# Altium project Pixhack2.81.PrjPcb
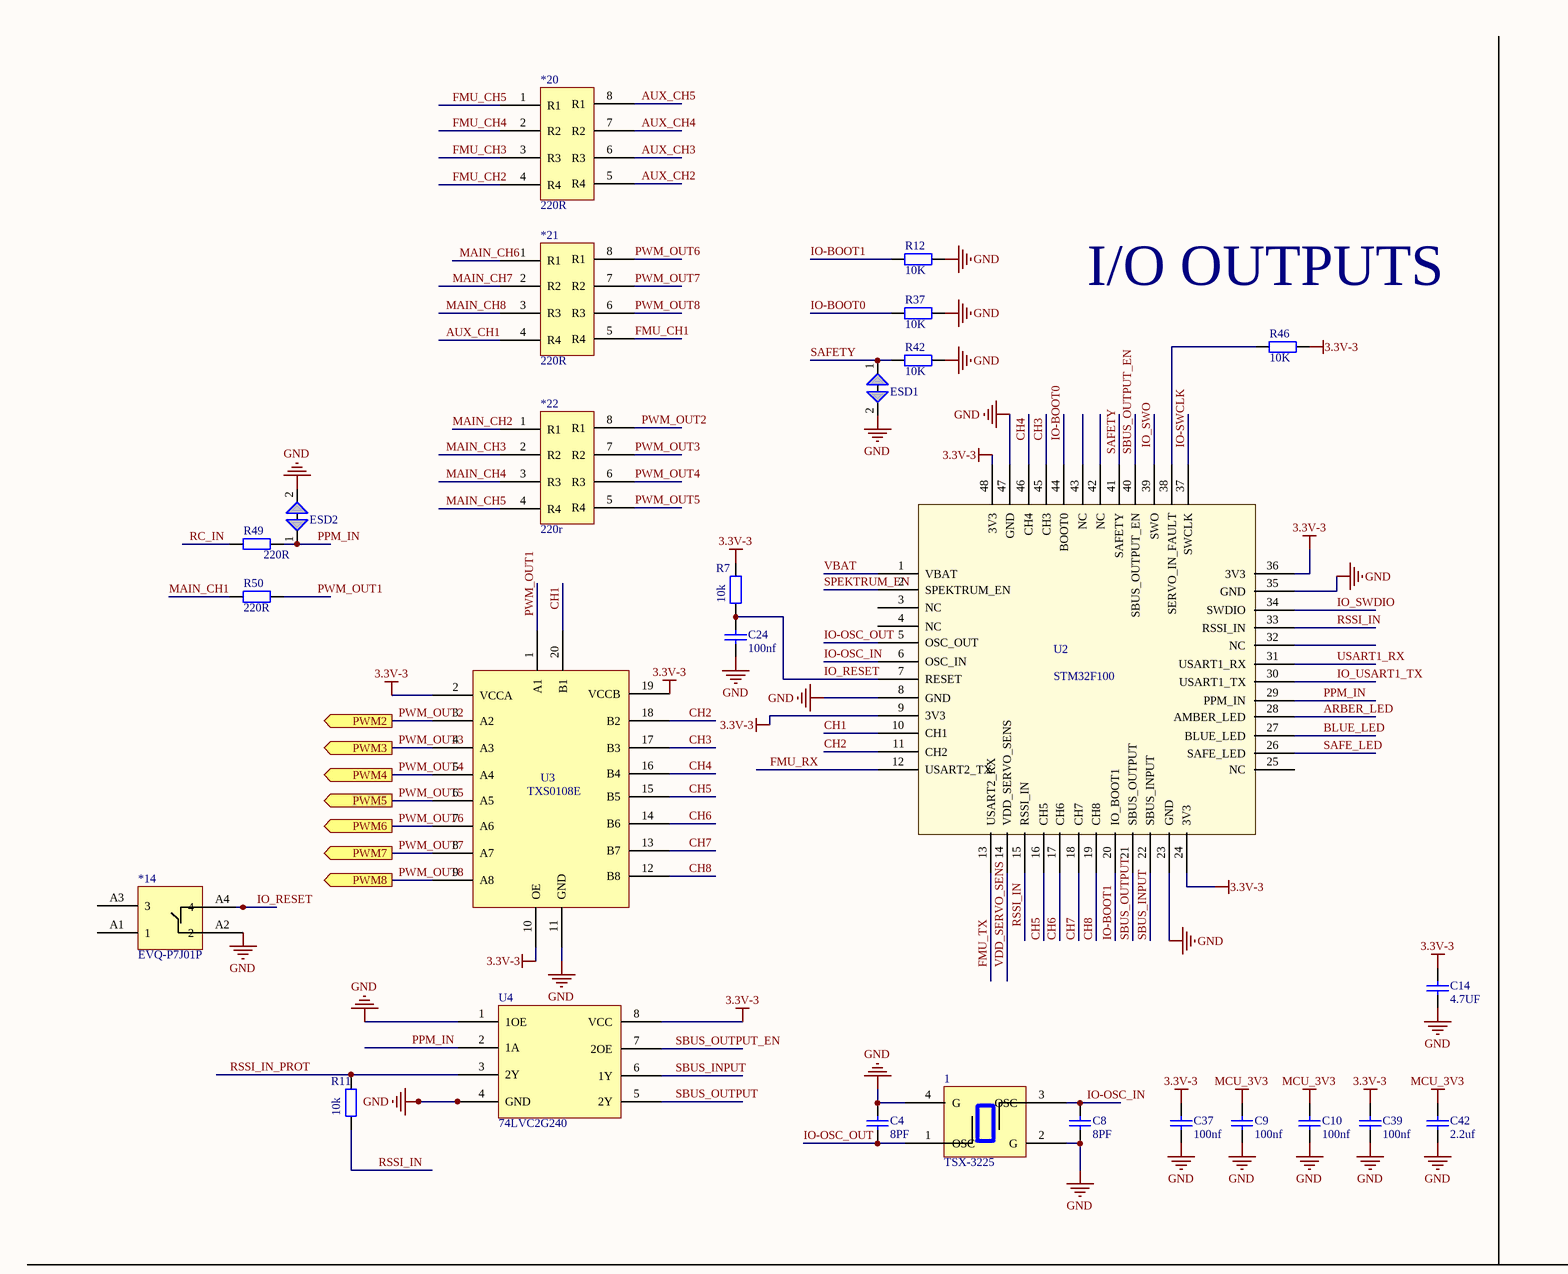
[diagram p0: NEW_LDO_PIX_SH.SchDoc, top left]
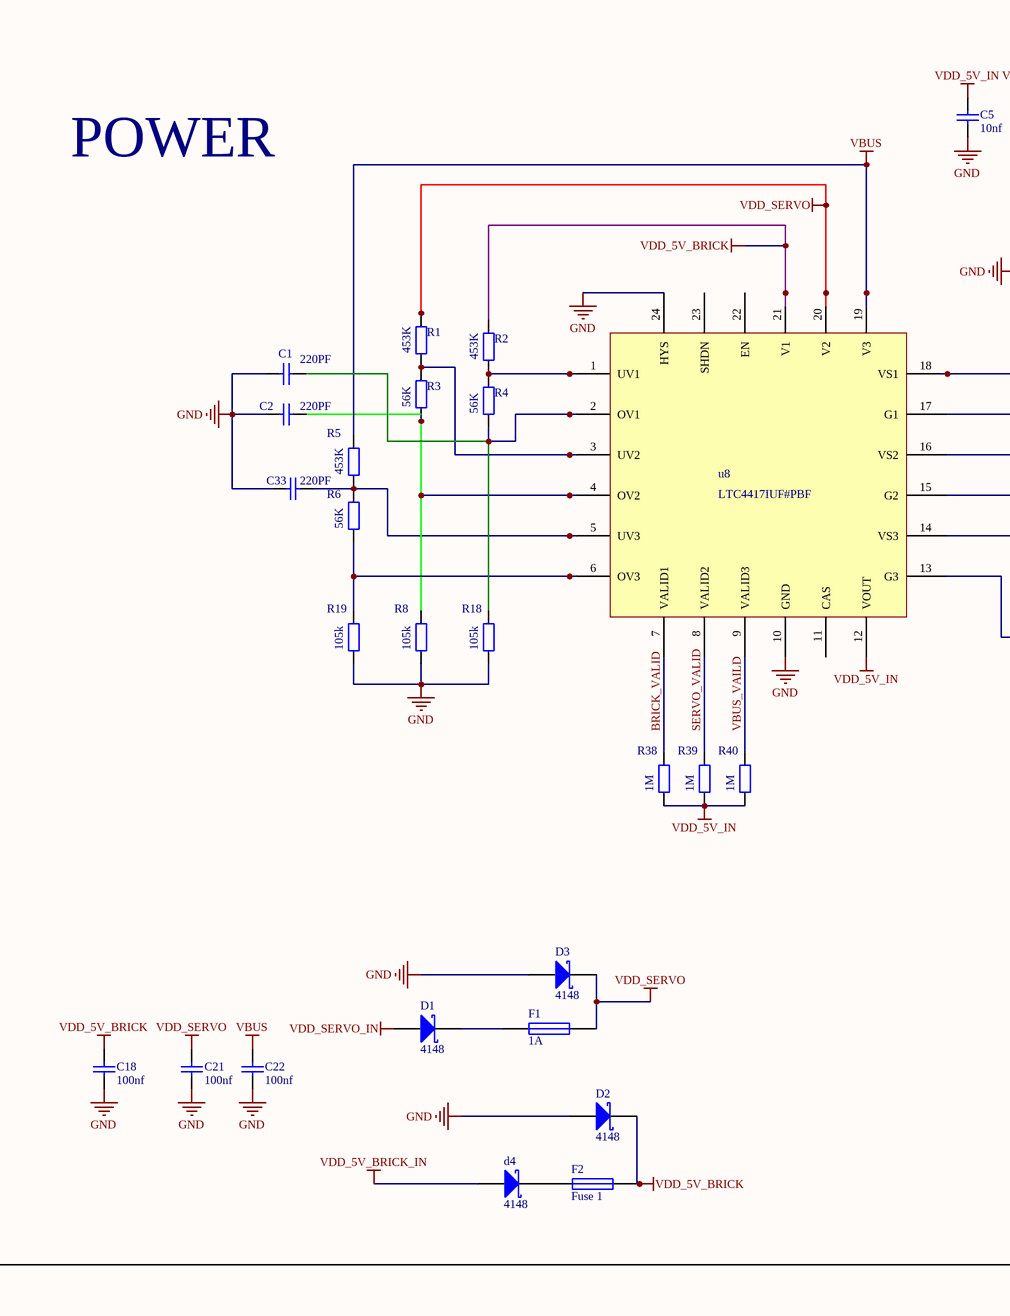
[diagram p1: NEW_LDO_PIX_SH.SchDoc, top middle]
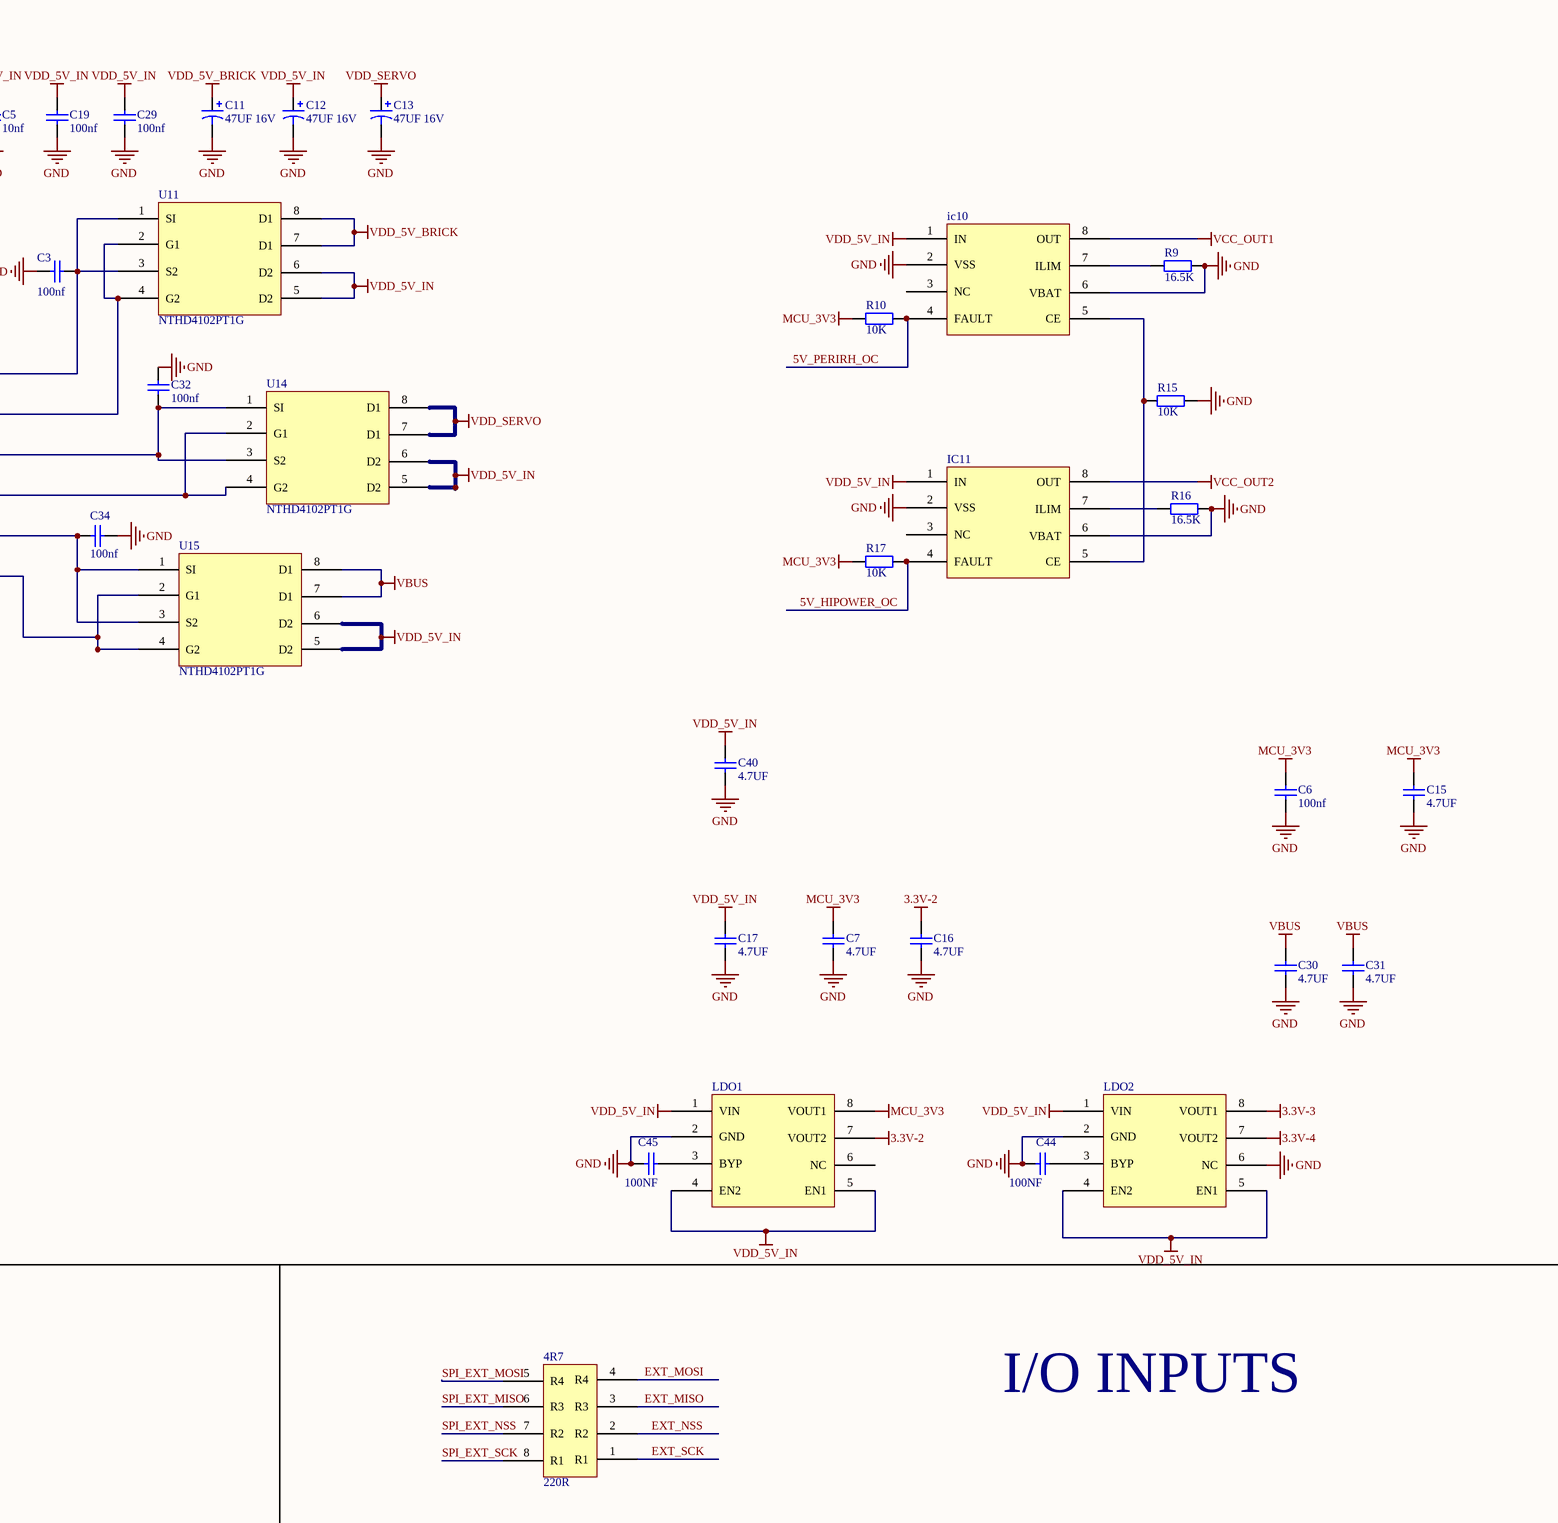
[diagram p2: NEW_LDO_PIX_SH.SchDoc, top right]
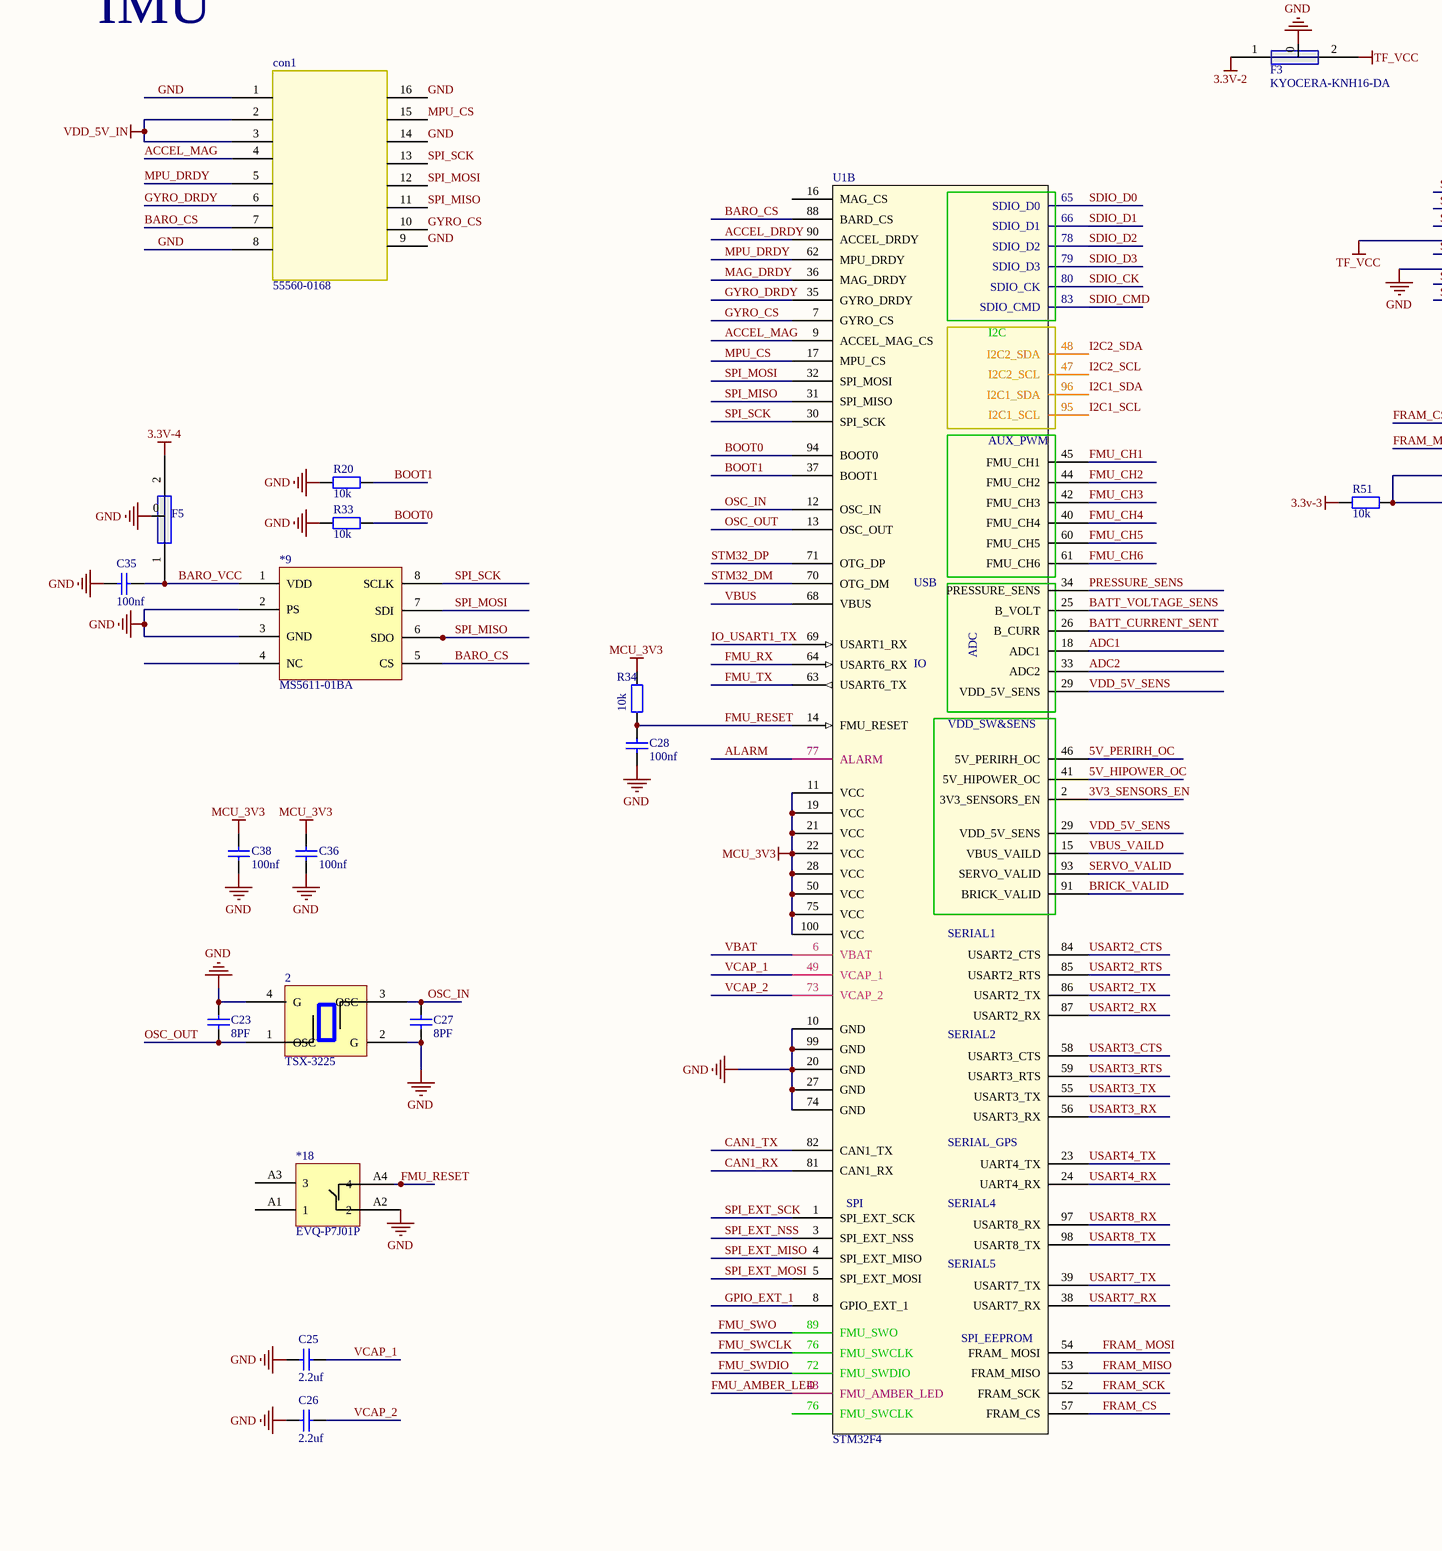
[diagram p3: NEW_LDO_PIX_SH.SchDoc, bottom left]
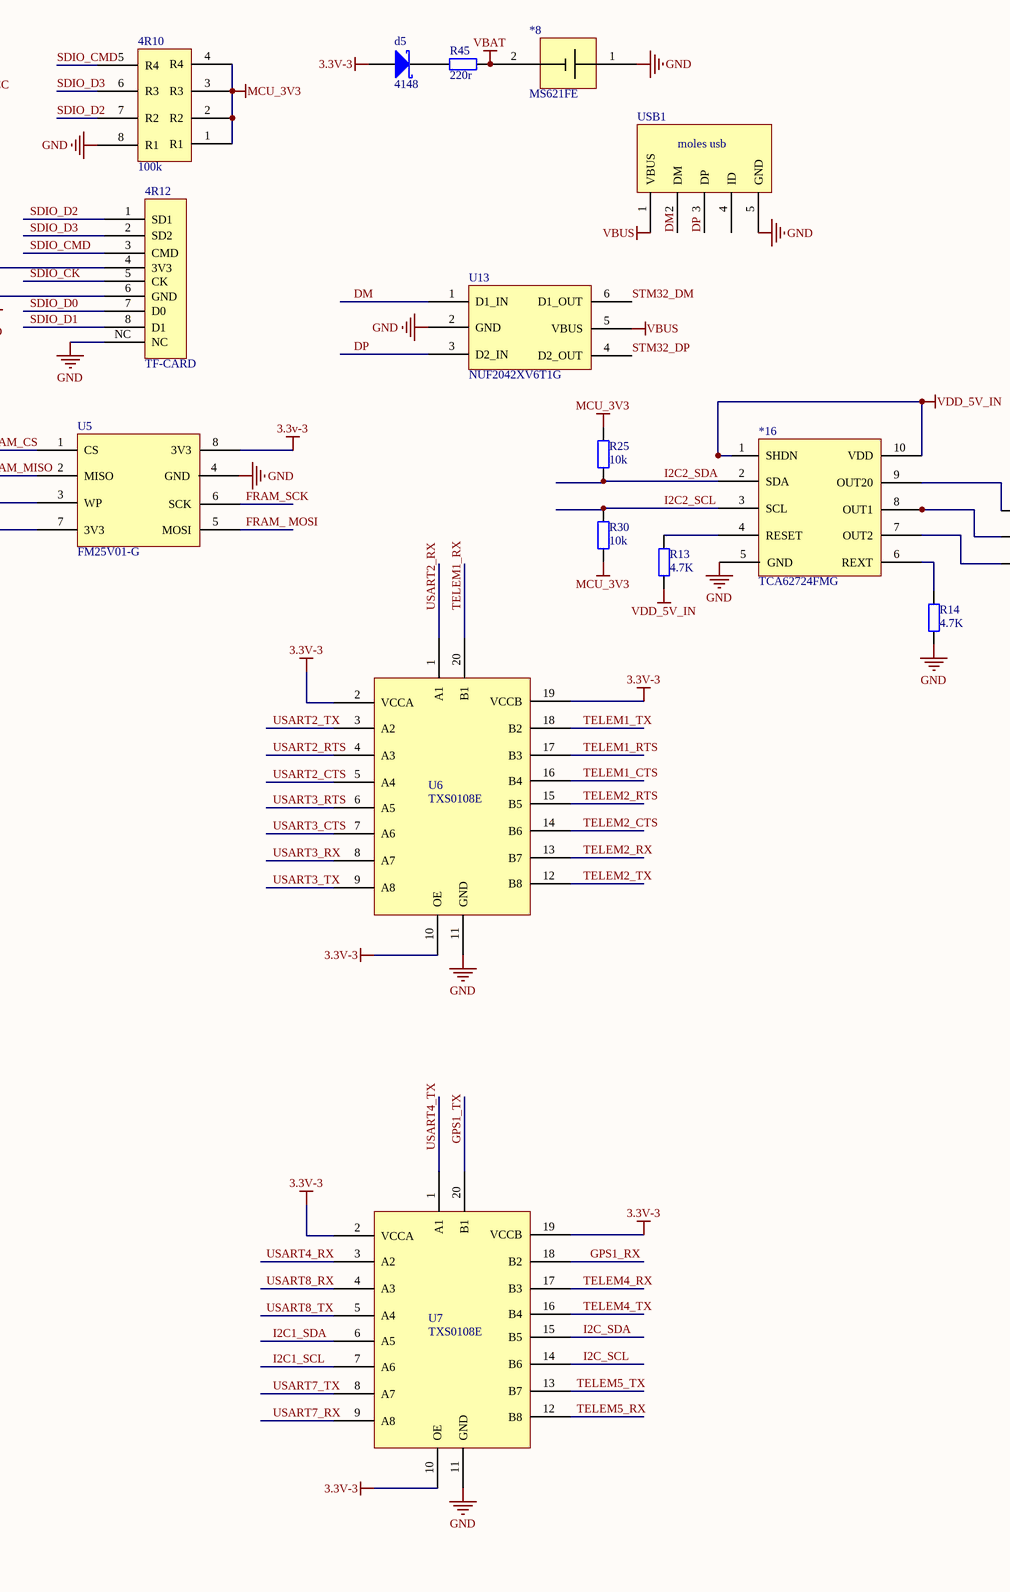
[diagram p4: NEW_LDO_PIX_SH.SchDoc, bottom middle]
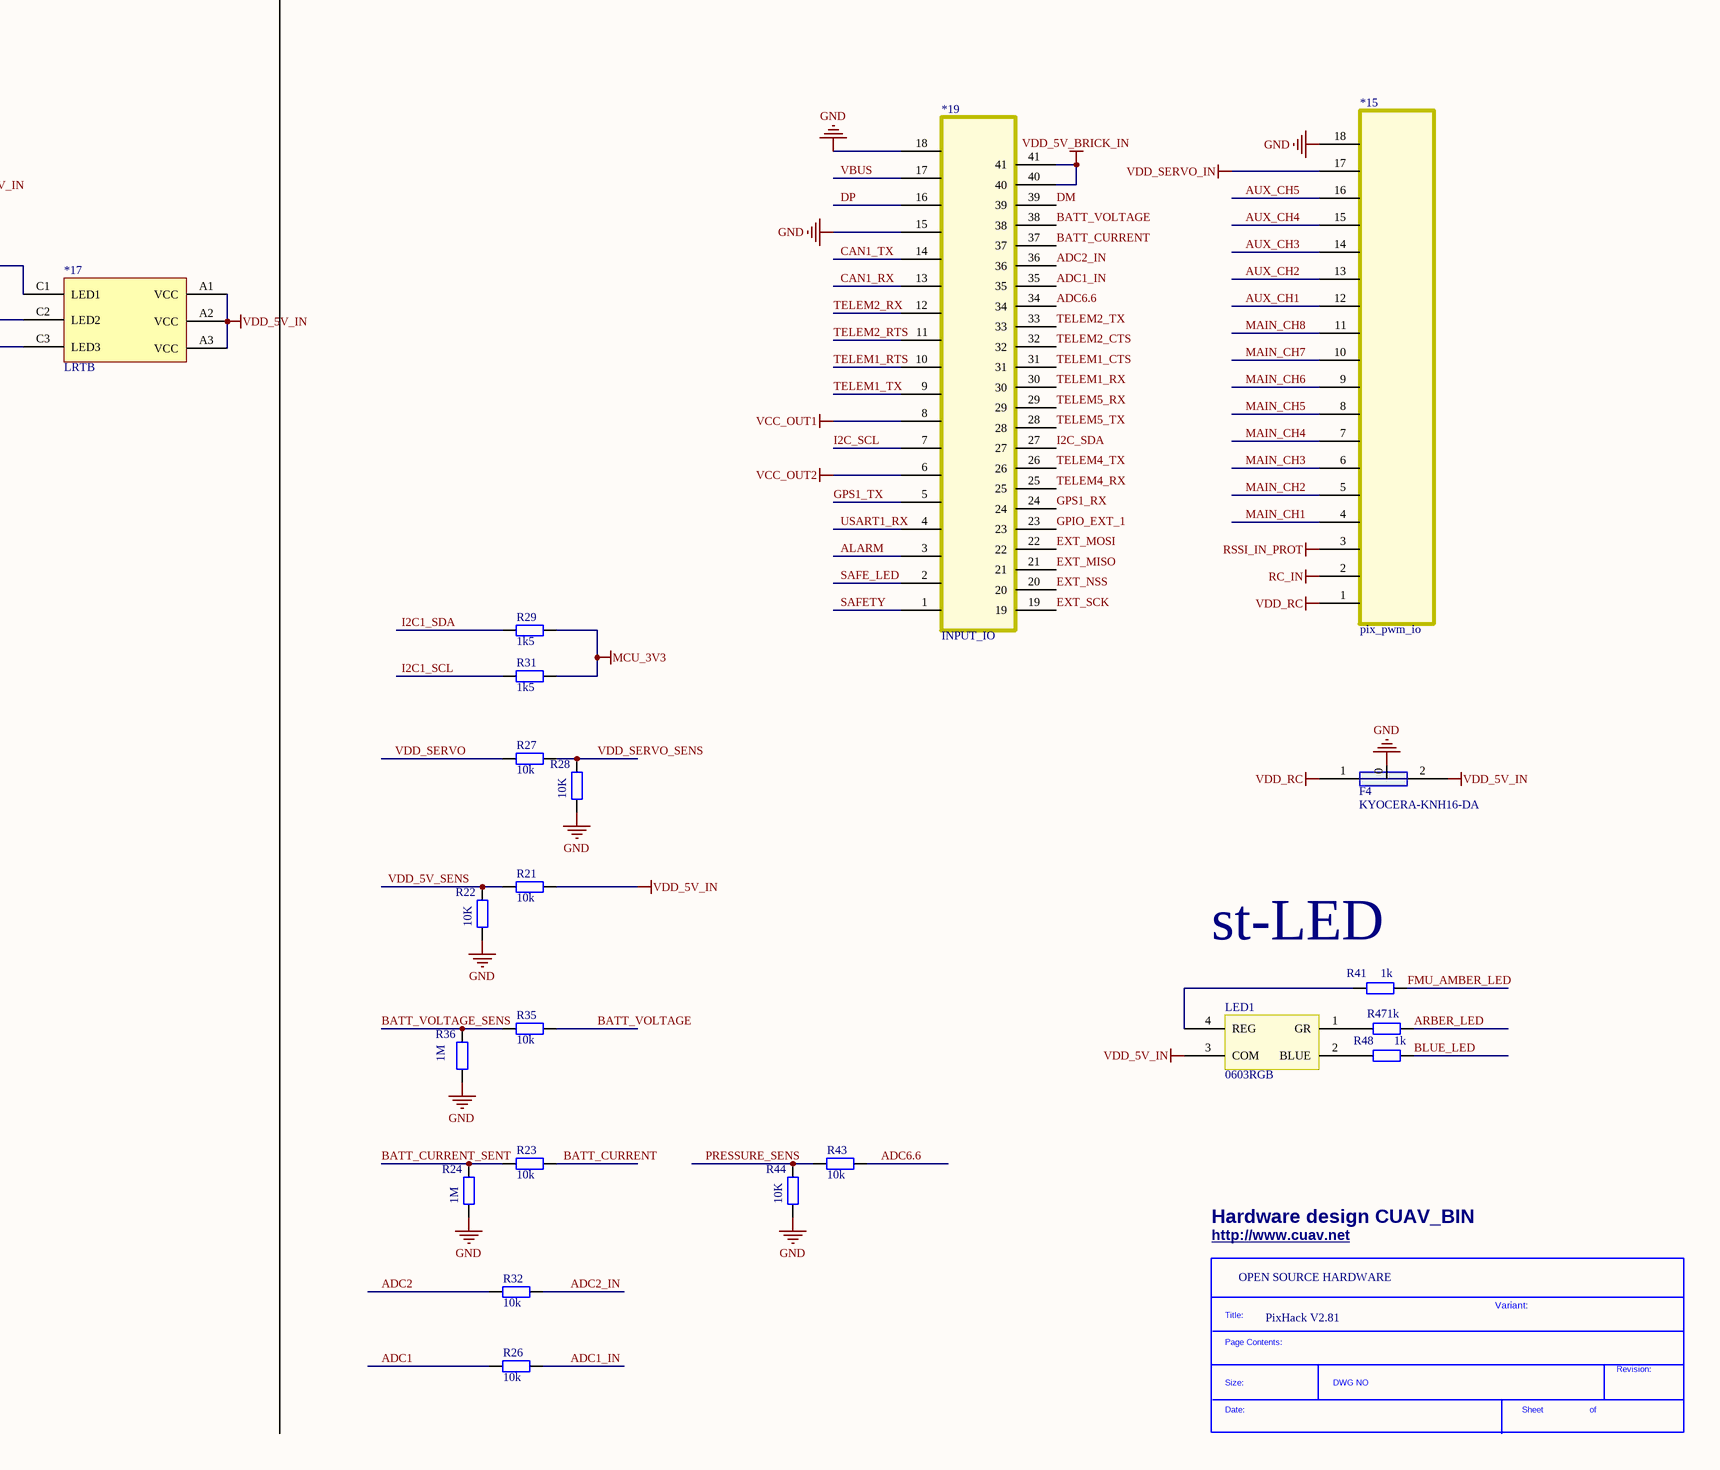
[diagram p5: NEW_LDO_PIX_SH.SchDoc, bottom right]
1 sheet, 141 parts. Net scope: flat (ports and power ports of the same name join across sheets).
Board file: PIXHACK.PcbDoc

## Sheet NEW_LDO_PIX_SH.SchDoc
size A1

### Parts
1  TSX-3225  [TSX-3225]
2  TSX-3225  [TSX-3225]
4R7  220R  [0402_4R]
4R10  100k  [0402_4R]
4R12  TF-CARD  [47352-1001]
*  SDTitleBlock  (value not drawn)  (graphical)
*8  MS621FE  [MS621FE]
*9  MS5611-01BA  [MS5611]
*14  EVQ-P7J01P  [EVQ-P7J01P]
*15  pix_pwm_io  [pix_pwm_out]
*16  TCA62724FMG  [SON10]
*17  LRTB  [LRTB]
*18  EVQ-P7J01P  [EVQ-P7J01P]
*19  INPUT_IO  [PIX_OP]
*20  220R  [0402_4R]
*21  220R  [0402_4R]
*22  220r  [0402_4R]
C1  220PF  [0402CAP]
C2  220PF  [0402CAP]
C3  100nf  [0402CAP]
C4  8PF  [0402CAP]
C5  10nf  [0402CAP]
C6  100nf  [0402CAP]
C7  4.7UF  [0805CAP]
C8  8PF  [0402CAP]
C9  100nf  [0402CAP]
C10  100nf  [0402CAP]
C11  47UF 16V  [7343CAP]
C12  47UF 16V  [7343CAP]
C13  47UF 16V  [7343CAP]
C14  4.7UF  [0805CAP]
C15  4.7UF  [0805CAP]
C16  4.7UF  [0805CAP]
C17  4.7UF  [0805CAP]
C18  100nf  [0402CAP]
C19  100nf  [0402CAP]
C21  100nf  [0402CAP]
C22  100nf  [0402CAP]
C23  8PF  [0402CAP]
C24  100nf  [0402CAP]
C25  2.2uf  [0402CAP]
C26  2.2uf  [0402CAP]
C27  8PF  [0402CAP]
C28  100nf  [0402CAP]
C29  100nf  [0402CAP]
C30  4.7UF  [0805CAP]
C31  4.7UF  [0805CAP]
C32  100nf  [0402CAP]
C33  220PF  [0402CAP]
C34  100nf  [0402CAP]
C35  100nf  [0402CAP]
C36  100nf  [0402CAP]
C37  100nf  [0402CAP]
C38  100nf  [0402CAP]
C39  100nf  [0402CAP]
C40  4.7UF  [0805CAP]
C42  2.2uf  [0402CAP]
C44  100NF  [0402CAP]
C45  100NF  [0402CAP]
con1  55560-0168  [547220164]
D1  4148  [SOD-123]
D2  4148  [SOD-123]
D3  4148  [SOD-123]
d4  4148  [SOD-123]
d5  4148  [SOD323]
ESD1  ESD0402  [ESD0402]  (value not drawn)
ESD2  ESD0402  [ESD0402]  (value not drawn)
F1  1A  [0805L]
F2  Fuse 1  [0805L]
F3  KYOCERA-KNH16-DA  [KYOCERA-KNH16-DA]
F4  KYOCERA-KNH16-DA  [KYOCERA-KNH16-DA]
F5  KYOCERA-KNH16-DA  [KYOCERA-KNH16-DA]  (value not drawn)
ic10  BQ243156  [QFN8]  (value not drawn)
IC11  BQ243156  [QFN8]  (value not drawn)
LDO1  MIC5530  [MIC5530]  (value not drawn)
LDO2  MIC5530  [MIC5530]  (value not drawn)
LED1  0603RGB  [0603RGB]
R1  453K  [R0402]
R2  453K  [R0402]
R3  56K  [R0402]
R4  56K  [R0402]
R5  453K  [R0402]
R6  56K  [R0402]
R7  10k  [R0402]
R8  105k  [R0402]
R9  16.5K  [R0402]
R10  10K  [R0402]
R11  10k  [R0402]
R12  10K  [R0402]
R13  4.7K  [R0402]
R14  4.7K  [R0402]
R15  10K  [R0402]
R16  16.5K  [R0402]
R17  10K  [R0402]
R18  105k  [R0402]
R19  105k  [R0402]
R20  10k  [R0402]
R21  10k  [R0402]
R22  10K  [R0402]
R23  10k  [R0402]
R24  1M  [R0402]
R25  10k  [R0402]
R26  10k  [R0402]
R27  10k  [R0402]
R28  10K  [R0402]
R29  1k5  [R0402]
R30  10k  [R0402]
R31  1k5  [R0402]
R32  10k  [R0402]
R33  10k  [R0402]
R34  10k  [R0402]
R35  10k  [R0402]
R36  1M  [R0402]
R37  10K  [R0402]
R38  1M  [R0402]
R39  1M  [R0402]
R40  1M  [R0402]
R41  1k  [R0402]
R42  10K  [R0402]
R43  10k  [R0402]
R44  10K  [R0402]
R45  220r  [R0402]
R46  10K  [R0402]
R47  1k  [R0402]
R48  1k  [R0402]
R49  220R  [R0402]
R50  220R  [R0402]
R51  10k  [R0402]
U1  STM32F4  [TQFP100_2]  (part B of 2)
U2  STM32F100  [TQFP48]
U3  TXS0108E  [QFN20-RGY]
U4  74LVC2G240  [TSSOP8 - duplicate]
U5  FM25V01-G  [SO-8]
U6  TXS0108E  [QFN20-RGY]
U7  TXS0108E  [QFN20-RGY]
u8  LTC4417IUF#PBF  [QFN24]
U11  NTHD4102PT1G  [1206A?03]
U13  NUF2042XV6T1G  [SOT563-6]
U14  NTHD4102PT1G  [1206A?03]
U15  NTHD4102PT1G  [1206A?03]
USB1  moles usb  [moles usb]

### Ports
PWM2 (out), PWM3 (out), PWM4 (out), PWM5 (out), PWM6 (out), PWM7 (out), PWM8 (out)

### Nets
3.3V-2: C16.2 F3.1 LDO1.7(VOUT2)
3.3V-3: C14.2 C37.2 C39.2 d5.1(A) LDO2.8(VOUT1) R7.2 R46.1 R51.2 U2.9(3V3) U2.24(3V3) U2.36(3V3) U2.48(3V3) U3.2(VCCA) U3.10(OE) U3.19(VCCB) U4.8(VCC) U5.8(3V3) U6.2(VCCA) U6.10(OE) U6.19(VCCB) U7.2(VCCA) U7.10(OE) U7.19(VCCB)
3.3V-4: F5.2 LDO2.7(VOUT2)
GND: 1.2(G) 1.4(G) 2.2(G) 2.4(G) 4R10.8(R1) 4R12.6(GND) 4R12.NC *8.1(VDD) *9.2(PS) *9.3(GND) *14.A2(2) *15.18 *16.5(GND) *18.A2(2) *19.15 *19.18 C1.2 C2.2 C3.2 C4.2 C5.1 C6.1 C7.1 C8.1 C9.1 C10.1 C11.C C12.C C13.C C14.1 C15.1 C16.1 C17.1 C18.1 C19.1 C21.1 C22.1 C23.2 C24.1 C25.1 C26.1 C27.1 C28.1 C29.1 C30.1 C31.1 C32.2 C33.2 C34.2 C35.2 C36.1 C37.1 C38.1 C39.1 C40.1 C42.1 C44.2 C45.2 con1.1 con1.8 con1.9 con1.14 con1.16 D2.1(A) D3.1(A) ESD1.2 ESD2.2 F3.0 F4.0 F5.0 ic10.2(VSS) ic10.6(VBAT) IC11.2(VSS) IC11.6(VBAT) LDO1.2(GND) LDO2.2(GND) LDO2.6(NC) R8.1 R9.1 R12.1 R14.1 R15.2 R16.2 R18.1 R19.1 R20.2 R22.1 R24.1 R28.1 R33.2 R36.1 R37.1 R42.1 R44.1 U1.10(GND) U1.20(GND) U1.27(GND) U1.74(GND) U1.99(GND) U2.8(GND) U2.23(GND) U2.35(GND) U2.47(GND) U3.11(GND) U4.1(1OE) U4.4(GND) U5.4(GND) U6.11(GND) U7.11(GND) u8.10(GND) u8.24(HYS) U13.2(GND) USB1.5(GND)
MCU_3V3: 4R10.1(R1) 4R10.2(R2) 4R10.3(R3) 4R10.4(R4) C6.2 C7.2 C9.2 C10.2 C15.2 C36.2 C38.2 C42.2 LDO1.8(VOUT1) R10.1 R17.1 R25.1 R29.1 R30.1 R31.1 R34.2 U1.11(VCC) U1.19(VCC) U1.21(VCC) U1.22(VCC) U1.28(VCC) U1.50(VCC) U1.75(VCC) U1.100(VCC)
RC_IN: *15.2 R49.1
RSSI_IN_PROT: *15.3 R11.2 U4.3(2Y)
TF_VCC: 4R12.4(3V3) F3.2
VBAT: *8.2(GND) R45.2 U1.6(VBAT) U2.1(VBAT)
VBUS: *19.17 C22.2 C30.2 C31.2 R5.2 U1.68(VBUS) u8.19(V3) U13.5(VBUS) U15.7(D1) U15.8(D1) USB1.1(VBUS)
VCC_OUT1: *19.8 ic10.8(OUT)
VCC_OUT2: *19.6 IC11.8(OUT)
VDD_5V_BRICK: C11.A C18.2 D2.2(K) F2.2 R2.2 u8.21(V1) U11.7(D1) U11.8(D1)
VDD_5V_BRICK_IN: *19.40 *19.41 d4.1(A)
VDD_5V_IN: *16.1(SHDN) *16.10(VDD) *17.A1(VCC) *17.A2(VCC) *17.A3(VCC) C5.2 C12.A C17.2 C19.2 C29.2 C40.2 con1.2 con1.3 F4.2 ic10.1(IN) IC11.1(IN) LDO1.1(VIN) LDO1.4(EN2) LDO1.5(EN1) LDO2.1(VIN) LDO2.4(EN2) LDO2.5(EN1) LED1.3(COM) R13.1 R21.2 R38.1 R39.1 R40.1 u8.12(VOUT) U11.5(D2) U11.6(D2) U14.5(D2) U14.6(D2) U15.5(D2) U15.6(D2)
VDD_RC: *15.1 F4.1
VDD_SERVO: C13.A C21.2 D3.2(K) F1.1 R1.2 R27.1 u8.20(V2) U14.7(D1) U14.8(D1)
VDD_SERVO_IN: *15.17 D1.1(A)
3V3_SENSORS_EN: U1.2(3V3_SENSORS_EN)
5V_HIPOWER_OC: IC11.4(FAULT) R17.2 U1.41(5V_HIPOWER_OC)
5V_PERIRH_OC: ic10.4(FAULT) R10.2 U1.46(5V_PERIRH_OC)
ACCEL_DRDY: U1.90(ACCEL_DRDY)
ACCEL_MAG: con1.4 U1.9(ACCEL_MAG_CS)
ADC1: R26.1 U1.18(ADC1)
ADC1_IN: *19.35 R26.2
ADC2: R32.1 U1.33(ADC2)
ADC2_IN: *19.36 R32.2
ADC6.6: *19.34 R43.2
ALARM: *19.3 U1.77(ALARM)
ARBER_LED: R47.2 U2.28(AMBER_LED)
AUX_CH1: *15.12 *21.4(R4)
AUX_CH2: *15.13 *20.5(R4)
AUX_CH3: *15.14 *20.6(R3)
AUX_CH4: *15.15 *20.7(R2)
AUX_CH5: *15.16 *20.8(R1)
BARO_CS: *9.5(CS) con1.7 U1.88(BARD_CS)
BARO_VCC: *9.1(VDD) C35.1 F5.1
BATT_CURRENT: *19.37 R23.2
BATT_CURRENT_SENT: R23.1 R24.2 U1.26(B_CURR)
BATT_VOLTAGE: *19.38 R35.2
BATT_VOLTAGE_SENS: R35.1 R36.2 U1.25(B_VOLT)
BLUE_LED: R48.2 U2.27(BLUE_LED)
BOOT0: R33.1 U1.94(BOOT0)
BOOT1: R20.1 U1.37(BOOT1)
BRICK_VALID: R38.2 U1.91(BRICK_VALID) u8.7(VALID1)
CAN1_RX: *19.13 U1.81(CAN1_RX)
CAN1_TX: *19.14 U1.82(CAN1_TX)
CH1: U2.10(CH1) U3.20(B1)
CH2: U2.11(CH2) U3.18(B2)
CH3: U2.45(CH3) U3.17(B3)
CH4: U2.46(CH4) U3.16(B4)
CH5: U2.16(CH5) U3.15(B5)
CH6: U2.17(CH6) U3.14(B6)
CH7: U2.18(CH7) U3.13(B7)
CH8: U2.19(CH8) U3.12(B8)
DM: *19.39 U13.1(D1_IN) USB1.2(DM)
DP: *19.16 U13.3(D2_IN) USB1.3(DP)
EXT_MISO: 4R7.3(R3) *19.21
EXT_MOSI: 4R7.4(R4) *19.22
EXT_NSS: 4R7.2(R2) *19.20
EXT_SCK: 4R7.1(R1) *19.19
FMU_AMBER_LED: R41.2 U1.43(FMU_AMBER_LED)
FMU_CH1: *21.5(R4) U1.45(FMU_CH1)
FMU_CH2: *20.4(R4) U1.44(FMU_CH2)
FMU_CH3: *20.3(R3) U1.42(FMU_CH3)
FMU_CH4: *20.2(R2) U1.40(FMU_CH4)
FMU_CH5: *20.1(R1) U1.60(FMU_CH5)
FMU_CH6: U1.61(FMU_CH6)
FMU_RESET: *18.A4(4) C28.2 R34.1 U1.14(FMU_RESET)
FMU_RX: U1.64(USART6_RX) U2.12(USART2_TX)
FMU_SWCLK: U1.76(FMU_SWCLK)
FMU_SWDIO: U1.72(FMU_SWDIO)
FMU_SWO: U1.89(FMU_SWO)
FMU_TX: U1.63(USART6_TX) U2.13(USART2_RX)
FRAM_ MOSI: U1.54(FRAM__MOSI) U5.5(MOSI)
FRAM_CS: U1.57(FRAM_CS) U5.1(CS)
FRAM_MISO: U1.53(FRAM_MISO) U5.2(MISO)
FRAM_SCK: U1.52(FRAM_SCK) U5.6(SCK)
GPIO_EXT_1: *19.23 U1.8(GPIO_EXT_1)
GPS1_RX: *19.24 U7.18(B2)
GPS1_TX: *19.5 U7.20(B1)
GYRO_CS: con1.10 U1.7(GYRO_CS)
GYRO_DRDY: con1.6 U1.35(GYRO_DRDY)
I2C1_SCL: R31.2 U1.95(I2C1_SCL) U7.7(A6)
I2C1_SDA: R29.2 U1.96(I2C1_SDA) U7.6(A5)
I2C2_SCL: *16.3(SCL) R30.2 U1.47(I2C2_SCL)
I2C2_SDA: *16.2(SDA) R25.2 U1.48(I2C2_SDA)
I2C_SCL: *19.7 U7.14(B6)
I2C_SDA: *19.27 U7.15(B5)
IO-BOOT0: R37.2 U2.44(BOOT0)
IO-BOOT1: R12.2 U2.20(IO_BOOT1)
IO-OSC_IN: 1.3(OSC) C8.2 U2.6(OSC_IN)
IO-OSC_OUT: 1.1(OSC) C4.1 U2.5(OSC_OUT)
IO-SWCLK: U2.37(SWCLK)
IO_RESET: *14.A4(4) C24.2 R7.1 U2.7(RESET)
IO_SWDIO: U2.34(SWDIO)
IO_SWO: U2.39(SWO)
IO_USART1_TX: U1.69(USART1_RX) U2.30(USART1_TX)
MAG_DRDY: U1.36(MAG_DRDY)
MAIN_CH1: *15.4 R50.1
MAIN_CH2: *15.5 *22.1(R1)
MAIN_CH3: *15.6 *22.2(R2)
MAIN_CH4: *15.7 *22.3(R3)
MAIN_CH5: *15.8 *22.4(R4)
MAIN_CH6: *15.9 *21.1(R1)
MAIN_CH7: *15.10 *21.2(R2)
MAIN_CH8: *15.11 *21.3(R3)
MPU_CS: con1.15 U1.17(MPU_CS)
MPU_DRDY: con1.5 U1.62(MPU_DRDY)
OSC_IN: 2.3(OSC) C27.2 U1.12(OSC_IN)
OSC_OUT: 2.1(OSC) C23.1 U1.13(OSC_OUT)
PPM_IN: ESD2.1 R49.2 U2.29(PPM_IN) U4.2(1A)
PRESSURE_SENS: R43.1 R44.2 U1.34(PRESSURE_SENS)
PWM_OUT1: R50.2 U3.1(A1)
PWM_OUT2: *22.8(R1) U3.3(A2) ; port PWM2
PWM_OUT3: *22.7(R2) U3.4(A3) ; port PWM3
PWM_OUT4: *22.6(R3) U3.5(A4) ; port PWM4
PWM_OUT5: *22.5(R4) U3.6(A5) ; port PWM5
PWM_OUT6: *21.8(R1) U3.7(A6) ; port PWM6
PWM_OUT7: *21.7(R2) U3.8(A7) ; port PWM7
PWM_OUT8: *21.6(R3) U3.9(A8) ; port PWM8
RSSI_IN: R11.1 U2.15(RSSI_IN) U2.33(RSSI_IN)
SAFE_LED: *19.2 U2.26(SAFE_LED)
SAFETY: *19.1 ESD1.1 R42.2 U2.41(SAFETY)
SBUS_INPUT: U2.22(SBUS_INPUT) U4.6(1Y)
SBUS_OUTPUT: U2.21(SBUS_OUTPUT) U4.5(2Y)
SBUS_OUTPUT_EN: U2.40(SBUS_OUTPUT_EN) U4.7(2OE)
SDIO_CK: 4R12.5(CK) U1.80(SDIO_CK)
SDIO_CMD: 4R10.5(R4) 4R12.3(CMD) U1.83(SDIO_CMD)
SDIO_D0: 4R12.7(D0) U1.65(SDIO_D0)
SDIO_D1: 4R12.8(D1) U1.66(SDIO_D1)
SDIO_D2: 4R10.7(R2) 4R12.1(SD1) U1.78(SDIO_D2)
SDIO_D3: 4R10.6(R3) 4R12.2(SD2) U1.79(SDIO_D3)
SERVO_VALID: R39.2 U1.93(SERVO_VALID) u8.8(VALID2)
SPEKTRUM_EN: U2.2(SPEKTRUM_EN)
SPI_EXT_MISO: 4R7.6(R3) U1.4(SPI_EXT_MISO)
SPI_EXT_MOSI: 4R7.5(R4) U1.5(SPI_EXT_MOSI)
SPI_EXT_NSS: 4R7.7(R2) U1.3(SPI_EXT_NSS)
SPI_EXT_SCK: 4R7.8(R1) U1.1(SPI_EXT_SCK)
SPI_MISO: *9.6(SDO) con1.11 U1.31(SPI_MISO)
SPI_MOSI: *9.7(SDI) con1.12 U1.32(SPI_MOSI)
SPI_SCK: *9.8(SCLK) con1.13 U1.30(SPI_SCK)
STM32_DM: U1.70(OTG_DM) U13.6(D1_OUT)
STM32_DP: U1.71(OTG_DP) U13.4(D2_OUT)
TELEM1_CTS: *19.31 U6.16(B4)
TELEM1_RTS: *19.10 U6.17(B3)
TELEM1_RX: *19.30 U6.20(B1)
TELEM1_TX: *19.9 U6.18(B2)
TELEM2_CTS: *19.32 U6.14(B6)
TELEM2_RTS: *19.11 U6.15(B5)
TELEM2_RX: *19.12 U6.13(B7)
TELEM2_TX: *19.33 U6.12(B8)
TELEM4_RX: *19.25 U7.17(B3)
TELEM4_TX: *19.26 U7.16(B4)
TELEM5_RX: *19.29 U7.12(B8)
TELEM5_TX: *19.28 U7.13(B7)
USART1_RX: *19.4 U2.31(USART1_RX)
USART2_CTS: U1.84(USART2_CTS) U6.5(A4)
USART2_RTS: U1.85(USART2_RTS) U6.4(A3)
USART2_RX: U1.87(USART2_RX) U6.1(A1)
USART2_TX: U1.86(USART2_TX) U6.3(A2)
USART3_CTS: U1.58(USART3_CTS) U6.7(A6)
USART3_RTS: U1.59(USART3_RTS) U6.6(A5)
USART3_RX: U1.56(USART3_RX) U6.8(A7)
USART3_TX: U1.55(USART3_TX) U6.9(A8)
USART4_RX: U1.24(UART4_RX) U7.3(A2)
USART4_TX: U1.23(UART4_TX) U7.1(A1)
USART7_RX: U1.38(USART7_RX) U7.9(A8)
USART7_TX: U1.39(USART7_TX) U7.8(A7)
USART8_RX: U1.97(USART8_RX) U7.4(A3)
USART8_TX: U1.98(USART8_TX) U7.5(A4)
VBUS_VAILD: R40.2 U1.15(VBUS_VAILD) u8.9(VALID3)
VCAP_1: C25.2 U1.49(VCAP_1)
VCAP_2: C26.2 U1.73(VCAP_2)
VDD_5V_SENS: R21.1 R22.2 U1.29(VDD_5V_SENS)
VDD_SERVO_SENS: R27.2 R28.2 U2.14(VDD_SERVO_SENS)
Net*16_4: *16.4(RESET) R13.2
Net*16_6: *16.6(REXT) R14.2
Net*16_7: *16.7(OUT2) *17.C3(LED3)
Net*16_8: *16.8(OUT1) *17.C2(LED2)
Net*16_9: *16.9(OUT20) *17.C1(LED1)
NetC1_1: C1.1 R4.1 R18.2 u8.2(OV1)
NetC2_1: C2.1 R3.1 R8.2 u8.4(OV2)
NetC3_1: C3.1 u8.18(VS1) U11.1(SI) U11.3(S2)
NetC32_1: C32.1 u8.16(VS2) U14.1(SI) U14.3(S2)
NetC33_1: C33.1 R5.1 R6.2 u8.5(UV3)
NetC34_1: C34.1 u8.14(VS3) U15.1(SI) U15.3(S2)
NetC44_1: C44.1 LDO2.3(BYP)
NetC45_1: C45.1 LDO1.3(BYP)
NetD1_2: D1.2(K) F1.2
Netd4_2: d4.2(K) F2.1
Netd5_2: d5.2(K) R45.1
Netic10_5: ic10.5(CE) IC11.5(CE) R15.1
Netic10_7: ic10.7(ILIM) R9.2
NetIC11_7: IC11.7(ILIM) R16.1
NetLED1_1: LED1.1(GR) R47.1
NetLED1_2: LED1.2(BLUE) R48.1
NetLED1_4: LED1.4(REG) R41.1
NetR1_1: R1.1 R3.2 u8.3(UV2)
NetR2_1: R2.1 R4.2 u8.1(UV1)
NetR6_1: R6.1 R19.2 u8.6(OV3)
NetR46_2: R46.2 U2.38(SERVO_IN_FAULT)
NetR51_1: R51.1 U5.3(WP) U5.7(3V3)
Netu8_13: u8.13(G3) U15.2(G1) U15.4(G2)
Netu8_15: u8.15(G2) U14.2(G1) U14.4(G2)
Netu8_17: u8.17(G1) U11.2(G1) U11.4(G2)

Not connected (* = marked no-connect by the designer): *9 4(NC); *14 A1(1) A3(3); *18 A1(1) A3(3); ic10 3(NC); IC11 3(NC); LDO1 6(NC); U1 16(MAG_CS); U2 3(NC) 4(NC) 25(NC) 32(NC) 42(NC) 43(NC); u8 11(CAS) 22(EN) 23(SHDN); USB1 4(ID)

### Notes on the sheet
- POWER
- (near R46) I/O OUTPUTS
- IMU
- I/O INPUTS
- (near R41) st-LED
- (near *) Hardware design CUAV_BIN
- (near *) http://www.cuav.net
- (near *) OPEN SOURCE HARDWARE
- PixHack V2.81
- Variant:
- (in symbol SDTitleBlock) Title:; Page Contents:; Revision:; Size:; DWG NO; Date:; Sheet; of
- (in symbol STM32F4, part B) I2C; AUX_PWM; USB; ADC; IO; VDD_SW&SENS; SERIAL1; SERIAL2; SERIAL_GPS; SPI; SERIAL4; SERIAL5; SPI_EEPROM

### Library data of the parts
4R7 4R10 *20-*22 = 0402_4R
4R12 = 47352-1001
C1-C10 C14-C19 C21-C40 C42 C44 C45 = Cap: Value: 100pF; Published: 8-Jun-2000; LatestRevisionDate: 17-Jul-2002; LatestRevisionNote: Re-released for DXP Platform.; PackageReference: RAD-0.3; Publisher: Altium Limited; PackageDescription: Radial Cap, Thru-Hole; 2 Leads; 0.3 in Pin Spacing
C11-C13 = Cap Pol1: Polarized Capacitor (Radial); Value: 100pF; Published: 8-Jun-2000; LatestRevisionDate: 17-Jul-2002; LatestRevisionNote: Re-released for DXP Platform.; PackageReference: RB7.6-15; Publisher: Altium Limited; PackageDescription: Polarized Capacitor (Radial); 2 Leads
D1-D3 d4 d5 = D Schottky: Schottky Diode; Published: 8-Jun-2000; LatestRevisionDate: 17-Jul-2002; LatestRevisionNote: Re-released for DXP Platform.; PackageReference: SMB; Publisher: Altium Limited; PackageDescription: DO-214-AA/SMB; 2 C-Bend Leads; Body 5.3 x 3.6 mm, inc. leads (LxW); Code_JEDEC: DO-214-AA
F1 F2 = Fuse 1: Fuse; Published: 8-Jun-2000; LatestRevisionDate: 17-Jul-2002; LatestRevisionNote: Re-released for DXP Platform.; PackageReference: PIN-W2/E2.8; Publisher: Altium Limited; PackageDescription: Thru-Hole; 2 Leads
R1-R40 R42-R46 R49-R51 = Res2: Resistor; Value: 1K; Published: 8-Jun-2000; LatestRevisionDate: 17-Jul-2002; LatestRevisionNote: Re-released for DXP Platform.; PackageReference: AXIAL-0.4; Publisher: Altium Limited; PackageDescription: Axial Device, Thru-Hole; 2 Leads; 0.4 in Pin Spacing
R41 R47 R48 = Res2: Resistor; Published: 8-Jun-2000; LatestRevisionDate: 17-Jul-2002; LatestRevisionNote: Re-released for DXP Platform.; PackageReference: AXIAL-0.4; Publisher: Altium Limited; PackageDescription: Axial Device, Thru-Hole; 2 Leads; 0.4 in Pin Spacing; Value: 1K
U5 = Component_1